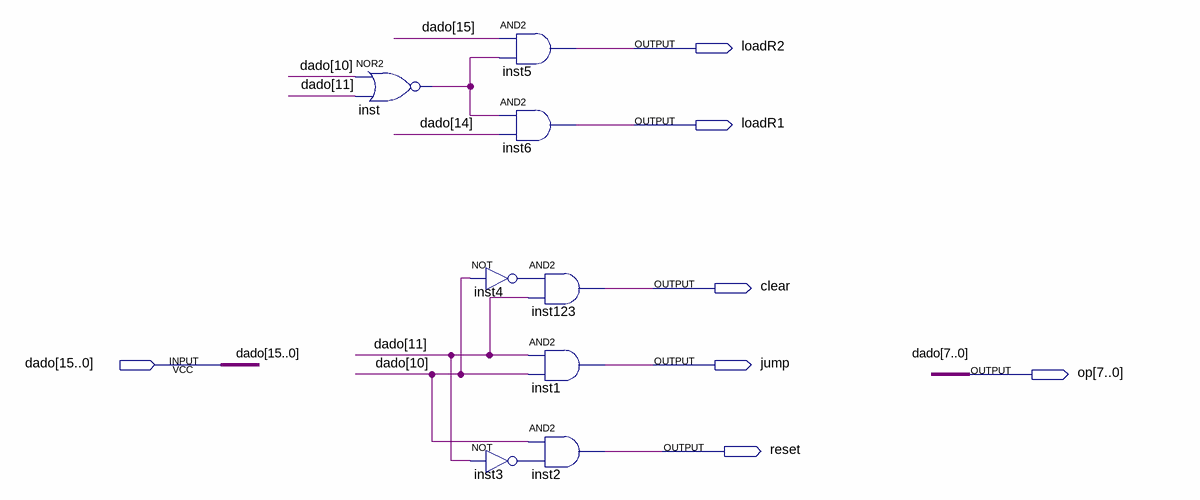
[diagram p0: schematic sheet]
// Quartus schematic UniControl.bdf as structural Verilog: 8 symbols, 7 pins
module UniControl (
  input  [15:0] dado,
  output loadR2,
  output loadR1,
  output clear,
  output jump,
  output [7:0] op,
  output reset
);

  wire inst3_out, inst4_out, inst_out;

  nor inst (inst_out, dado[10], dado[11]);
  and inst5 (loadR2, dado[15], inst_out);
  and inst6 (loadR1, inst_out, dado[14]);
  not inst4 (inst4_out, dado[10]);
  not inst3 (inst3_out, dado[11]);
  and inst123 (clear, inst4_out, dado[11]);
  and inst1 (jump, dado[11], dado[10]);
  and inst2 (reset, dado[10], inst3_out);

  assign op = dado[7:0];
endmodule
